# EAGLE design voltage-amplifier (EAGLE 9.6.2)
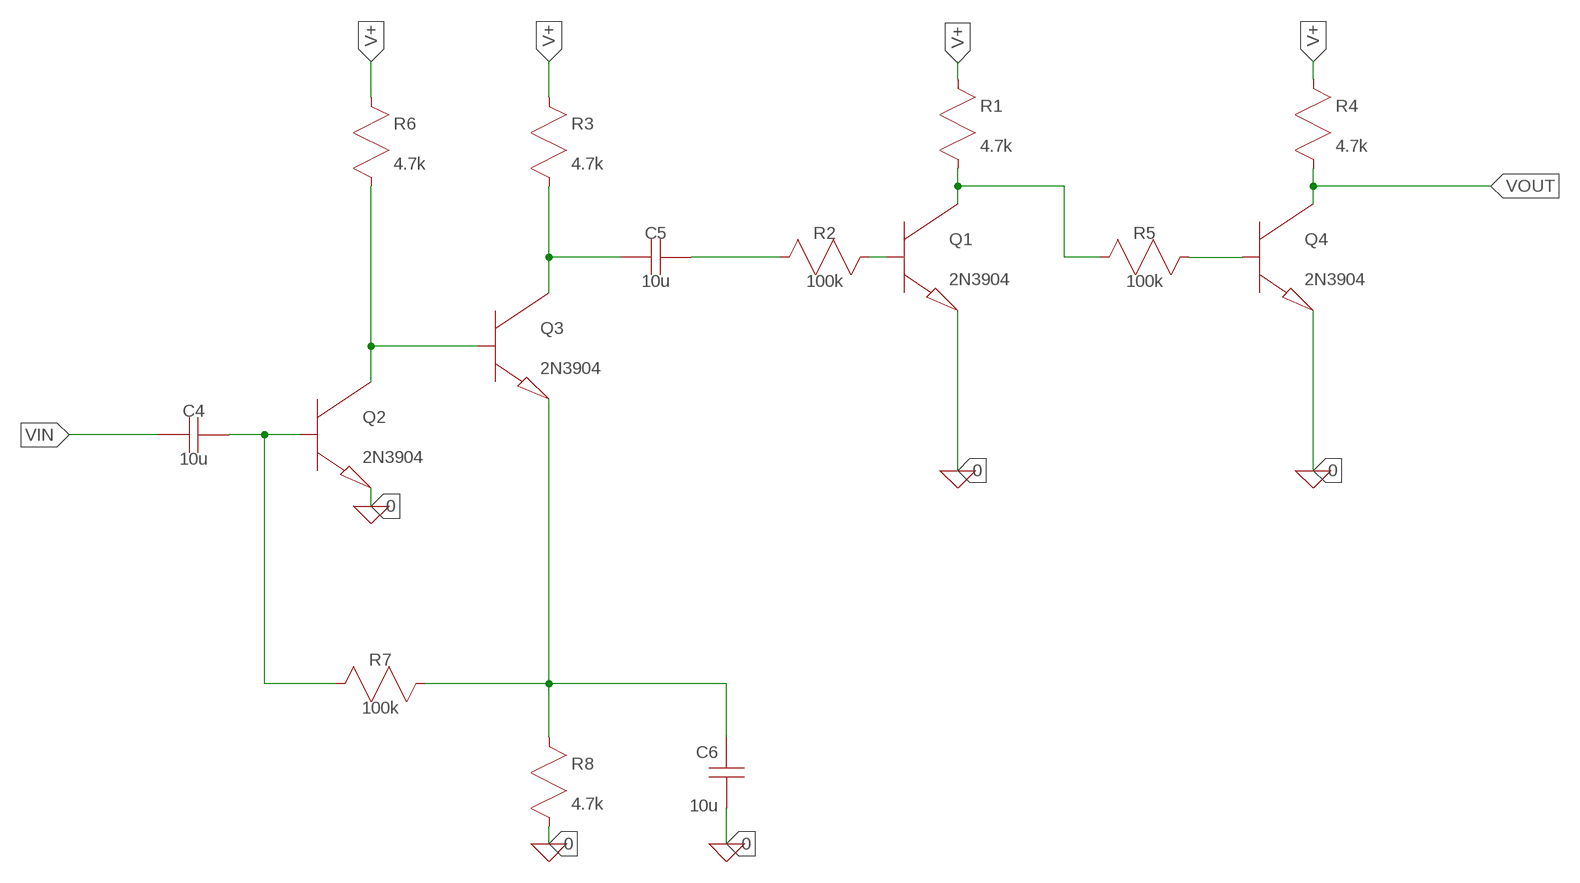
[diagram p0: schematic, sheet 1]

## Parts
C4  10u  CAP  [C050-025X075]
C5  10u  CAP  [C050-025X075]
C6  10u  CAP  [C050-025X075]
Q1  2N3904  NPN  [TO92]
Q2  2N3904  NPN  [TO92]
Q3  2N3904  NPN  [TO92]
Q4  2N3904  NPN  [TO92]
R1  4.7k  RES  [0207/7]
R2  100k  RES'0309'  [0309/10]
R3  4.7k  RES  [0207/7]
R4  4.7k  RES  [0207/7]
R5  100k  RES'0309'  [0309/10]
R6  4.7k  RES  [0207/7]
R7  100k  RES'0309'  [0309/10]
R8  4.7k  RES  [0207/7]

## Nets
0: C6.1(A) Q1.1(E) Q2.1(E) Q4.1(E) R8.2(B) ; supply symbol labelled GND
N$1: Q4.2(B) R5.1(A)
N$3: Q1.3(C) R1.2(B) R5.2(B)
N$5: C5.2(B) Q3.3(C) R3.2(B)
N$6: C5.1(A) R2.2(B)
N$7: Q1.2(B) R2.1(A)
N$8: Q2.3(C) Q3.2(B) R6.2(B)
N$10: C4.1(A) Q2.2(B) R7.2(B)
N$11: C6.2(B) Q3.1(E) R7.1(A) R8.1(A)
V+: R1.1(A) R3.1(A) R4.1(A) R6.1(A)
VIN: C4.2(B)
VOUT: Q4.3(C) R4.2(B)

## Library data of the parts
C4-C6 = sym-toh:CAP: Capacitor
Q1-Q4 = sym-toh:NPN: Bipolar NPN transistor
R1-R8 = sym-toh:RES: A resistor

## Board
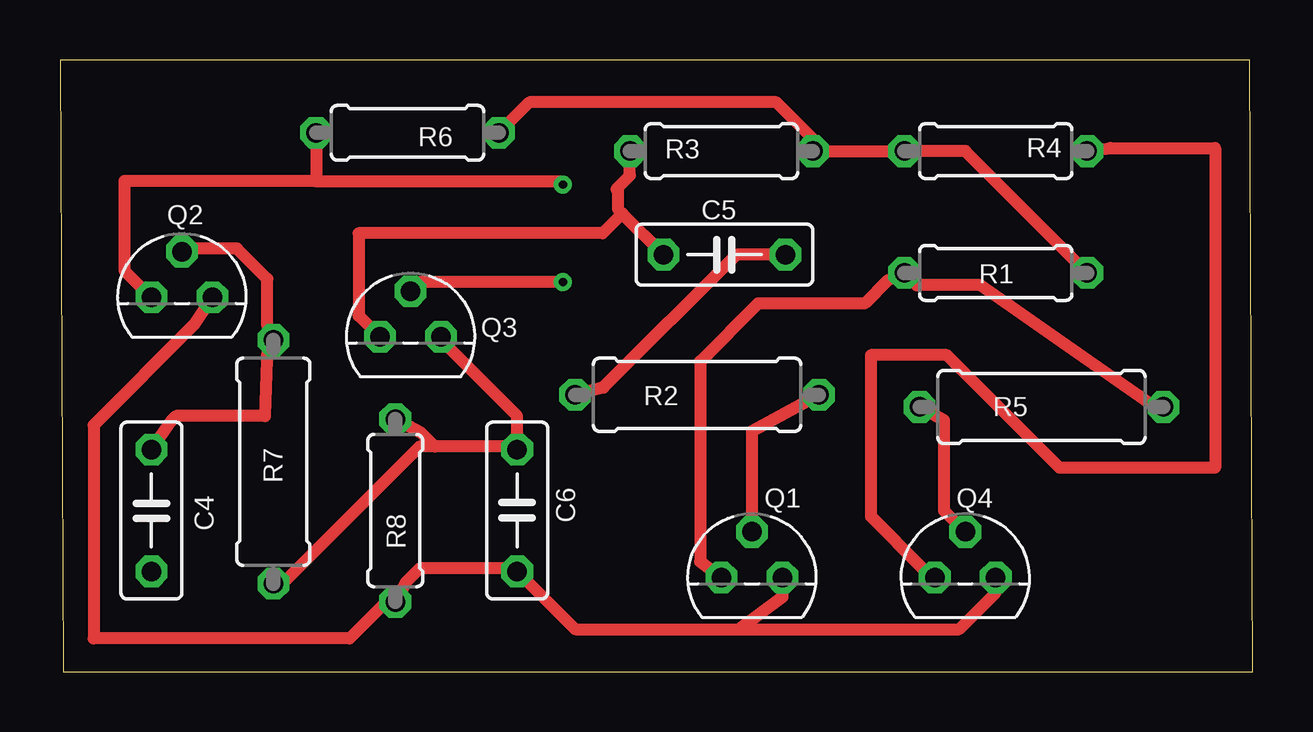
[diagram p1: board, top side]
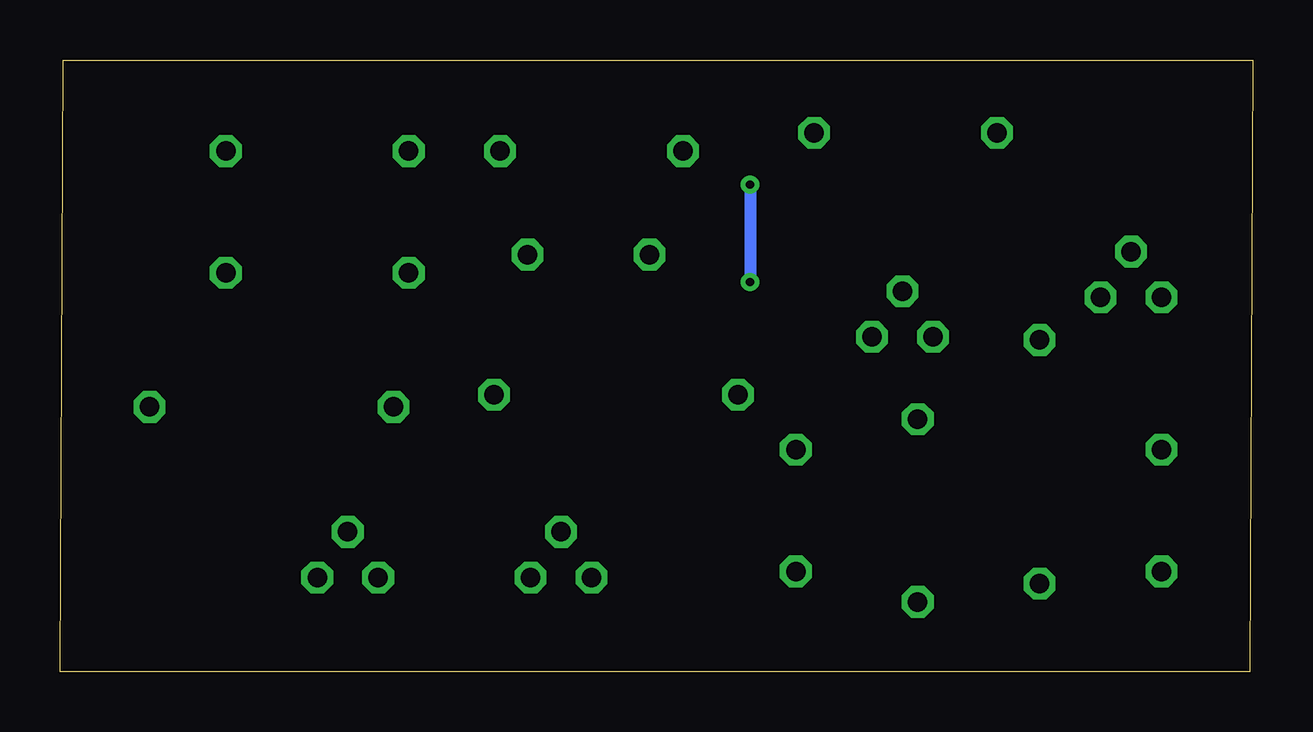
[diagram p2: board, bottom side, seen from below]

Size 49.71 x 25.52 mm. Coordinates in mm from the lower left corner, seen from the top.
Outline: 0.13,0 49.71,0 49.58,25.52 0,25.52 0.13,0
Copper layers (1*16): Top 0.035mm / dielectric 1.5mm / Bottom 0.035mm
Design rules "default *": minimum track width 0.5mm, minimum drill 0.35mm, track to track 1.5mm, track to pad 6mil, pad to pad 6mil, via to via 6mil, smd to smd 6mil, copper to edge 40mil, drill to drill 6mil, minimum pad ring 10mil, minimum via ring 8mil, stop-mask expansion 4mil, vias tented up to drill 0mil, thermal gap 10mil

### Footprints (pad centres in the part's own frame; a part is rotated, then mirrored left to right if it is on the bottom)
C050-025X075 = drill 0.813 octagon: 1 -2.54,0; 2 2.54,0
TO92 = drill 0.813 octagon: 1 1.27,0; 2 0,1.905; 3 -1.27,0
0207/7 = drill 0.813 octagon: 1 -3.81,0; 2 3.81,0
0309/10 = drill 0.813 octagon: 1 -5.08,0; 2 5.08,0

### Placement (x,y rotation side)
C4  3.81,6.73 270 top
C5  27.69,17.4 180 top
C6  19.05,6.73 90 top
Q1  28.83,3.94 0 top
Q2  5.08,15.62 0 top
Q3  14.61,13.97 0 top
Q4  37.72,3.94 0 top
R1  38.99,16.64 180 top
R2  26.54,11.56 180 top
R3  27.56,21.72 180 top
R4  38.99,21.72 0 top
R5  40.89,11.05 0 top
R6  14.48,22.48 180 top
R7  8.89,8.76 90 top
R8  13.97,6.73 270 top

### Tracks (layer width: path | path; a pad name or v marks a point on that pad's centre or on a via)
0
  Top 0.5: Q2.1 5.59,14.48 1.4,10.29 1.4,1.4 12.07,1.4 13.53,2.86 R8.2 14.42,3.75 14.99,4.32 19.03,4.32 C6.1 21.46,1.78 28.45,1.78 | Q1.1 30.1,3.11 28.29,1.78 37.47,1.78 38.99,3.3 Q4.1
N$1
  Top 0.5: R5.1 36.83,10.51 36.83,6.73 Q4.2
N$3
  Top 0.5: Q1.3 26.67,4.61 26.67,12.95 29.08,15.37 33.53,15.37 34.5,16.34 R1.2 35.69,16.13 38.35,16.13 45.61,11.05 R5.2
N$5
  Top 0.5: 23.43,19.11 22.61,18.29 12.45,18.29 12.45,14.86 Q3.3 | 23.37,21.72 R3.2 23.75,20.7 23.18,20.13 23.24,20.19 23.24,19.3 23.43,19.11 | 23.43,19.11 C5.2
N$6
  Top 0.5: C5.1 28.19,17.4 22.65,11.85 R2.2
N$7
  Top 0.5: R2.1 28.83,10.03 Q1.2
N$8  (via drill 0.35)
  Top 0.5: 3.81,15.94 Q2.3 2.69,16.75 2.69,20.47 10.67,20.47 R6.2 10.67,20.45 20.95,20.45 v20.95,20.32 | v20.95,16.26 14.99,16.26 Q3.2
  Bottom 0.5: v20.95,20.32 v20.95,16.26
N$10
  Top 0.5: C4.1 4.66,10.5 4.83,10.67 8.53,10.67 8.63,13.58 R7.2 8.64,14.42 8.64,16.38 7.37,17.65 5.52,17.65 Q2.2
N$11
  Top 0.5: 15.62,9.4 14.99,9.4 9.36,3.77 R7.1 | 15.62,9.4 15.06,9.96 R8.1 | Q3.1 15.88,13.84 19.05,10.67 C6.2 18.92,9.4 15.62,9.4
V+
  Top 0.5: R3.1 31.88,21.72 | 31.88,21.72 R4.1 37.72,21.72 R1.1 | R6.1 19.56,23.75 29.84,23.75 31.88,21.72
VOUT
  Top 0.5: Q4.3 35.93,4.33 33.78,6.48 33.78,13.21 36.96,13.21 41.66,8.51 48.13,8.51 48.13,21.84 43.77,21.84 R4.2